# EAGLE design lcmxo2-2000hc_bb (EAGLE 7.3.0)
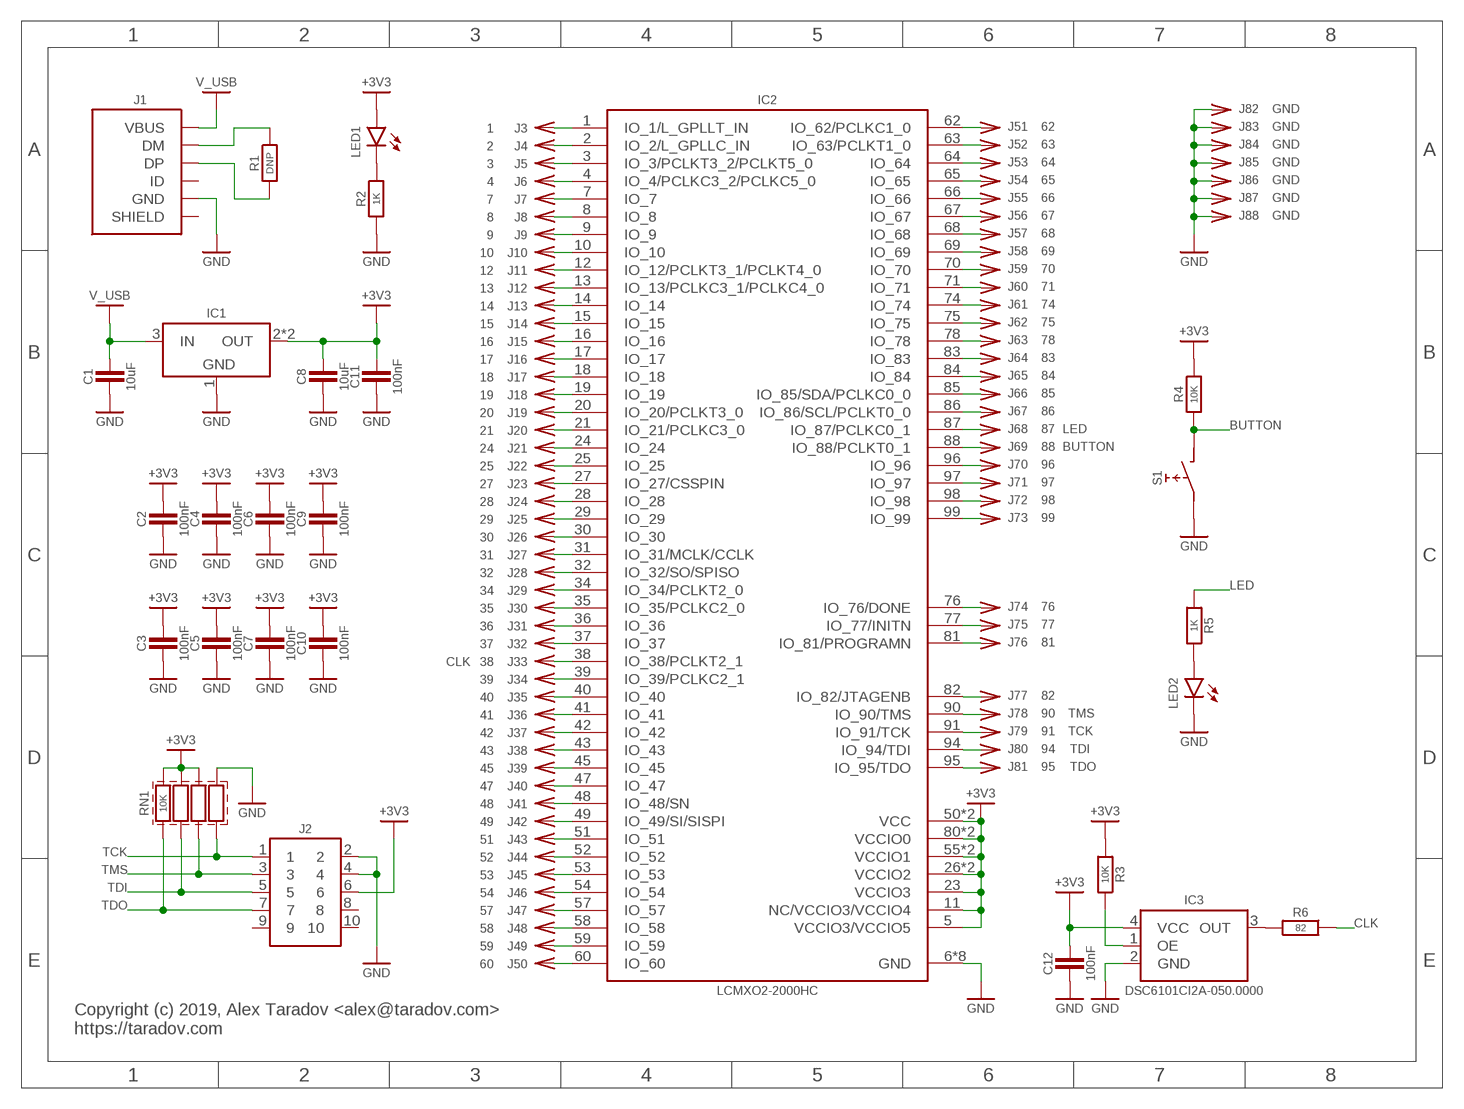
[diagram p0: schematic, sheet 1]

## Parts
C1  10uF  C-0805  [SMD0805]
C2  100nF  C-0603  [SMD0603]
C3  100nF  C-0603  [SMD0603]
C4  100nF  C-0603  [SMD0603]
C5  100nF  C-0603  [SMD0603]
C6  100nF  C-0603  [SMD0603]
C7  100nF  C-0603  [SMD0603]
C8  10uF  C-0805  [SMD0805]
C9  100nF  C-0603  [SMD0603]
C10  100nF  C-0603  [SMD0603]
C11  100nF  C-0603  [SMD0603]
C12  100nF  C-0603  [SMD0603]
IC1  LM1117-SOT223  [SOT223]
IC2  LCMXO2-2000HC  LCMXO2-100  [TQFP-100-0.5MM]
IC3  DSC6101CI2A-050.0000  OSC_EN-CDFN4  [CDFN4]
J1  USB-B-MICRO-SMT  [USB-B-MICRO-SMT-SHELL-TH]
J2  HEADER-5X2-TH-1.27  [HEADER-5X2-1.27MM]
J3  1  CONN-SINGLE-TH  [PIN-TH]
J4  2  CONN-SINGLE-TH  [PIN-TH]
J5  3  CONN-SINGLE-TH  [PIN-TH]
J6  4  CONN-SINGLE-TH  [PIN-TH]
J7  7  CONN-SINGLE-TH  [PIN-TH]
J8  8  CONN-SINGLE-TH  [PIN-TH]
J9  9  CONN-SINGLE-TH  [PIN-TH]
J10  10  CONN-SINGLE-TH  [PIN-TH]
J11  12  CONN-SINGLE-TH  [PIN-TH]
J12  13  CONN-SINGLE-TH  [PIN-TH]
J13  14  CONN-SINGLE-TH  [PIN-TH]
J14  15  CONN-SINGLE-TH  [PIN-TH]
J15  16  CONN-SINGLE-TH  [PIN-TH]
J16  17  CONN-SINGLE-TH  [PIN-TH]
J17  18  CONN-SINGLE-TH  [PIN-TH]
J18  19  CONN-SINGLE-TH  [PIN-TH]
J19  20  CONN-SINGLE-TH  [PIN-TH]
J20  21  CONN-SINGLE-TH  [PIN-TH]
J21  24  CONN-SINGLE-TH  [PIN-TH]
J22  25  CONN-SINGLE-TH  [PIN-TH]
J23  27  CONN-SINGLE-TH  [PIN-TH]
J24  28  CONN-SINGLE-TH  [PIN-TH]
J25  29  CONN-SINGLE-TH  [PIN-TH]
J26  30  CONN-SINGLE-TH  [PIN-TH]
J27  31  CONN-SINGLE-TH  [PIN-TH]
J28  32  CONN-SINGLE-TH  [PIN-TH]
J29  34  CONN-SINGLE-TH  [PIN-TH]
J30  35  CONN-SINGLE-TH  [PIN-TH]
J31  36  CONN-SINGLE-TH  [PIN-TH]
J32  37  CONN-SINGLE-TH  [PIN-TH]
J33  38  CONN-SINGLE-TH  [PIN-TH]
J34  39  CONN-SINGLE-TH  [PIN-TH]
J35  40  CONN-SINGLE-TH  [PIN-TH]
J36  41  CONN-SINGLE-TH  [PIN-TH]
J37  42  CONN-SINGLE-TH  [PIN-TH]
J38  43  CONN-SINGLE-TH  [PIN-TH]
J39  45  CONN-SINGLE-TH  [PIN-TH]
J40  47  CONN-SINGLE-TH  [PIN-TH]
J41  48  CONN-SINGLE-TH  [PIN-TH]
J42  49  CONN-SINGLE-TH  [PIN-TH]
J43  51  CONN-SINGLE-TH  [PIN-TH]
J44  52  CONN-SINGLE-TH  [PIN-TH]
J45  53  CONN-SINGLE-TH  [PIN-TH]
J46  54  CONN-SINGLE-TH  [PIN-TH]
J47  57  CONN-SINGLE-TH  [PIN-TH]
J48  58  CONN-SINGLE-TH  [PIN-TH]
J49  59  CONN-SINGLE-TH  [PIN-TH]
J50  60  CONN-SINGLE-TH  [PIN-TH]
J51  62  CONN-SINGLE-TH  [PIN-TH]
J52  63  CONN-SINGLE-TH  [PIN-TH]
J53  64  CONN-SINGLE-TH  [PIN-TH]
J54  65  CONN-SINGLE-TH  [PIN-TH]
J55  66  CONN-SINGLE-TH  [PIN-TH]
J56  67  CONN-SINGLE-TH  [PIN-TH]
J57  68  CONN-SINGLE-TH  [PIN-TH]
J58  69  CONN-SINGLE-TH  [PIN-TH]
J59  70  CONN-SINGLE-TH  [PIN-TH]
J60  71  CONN-SINGLE-TH  [PIN-TH]
J61  74  CONN-SINGLE-TH  [PIN-TH]
J62  75  CONN-SINGLE-TH  [PIN-TH]
J63  78  CONN-SINGLE-TH  [PIN-TH]
J64  83  CONN-SINGLE-TH  [PIN-TH]
J65  84  CONN-SINGLE-TH  [PIN-TH]
J66  85  CONN-SINGLE-TH  [PIN-TH]
J67  86  CONN-SINGLE-TH  [PIN-TH]
J68  87  CONN-SINGLE-TH  [PIN-TH]
J69  88  CONN-SINGLE-TH  [PIN-TH]
J70  96  CONN-SINGLE-TH  [PIN-TH]
J71  97  CONN-SINGLE-TH  [PIN-TH]
J72  98  CONN-SINGLE-TH  [PIN-TH]
J73  99  CONN-SINGLE-TH  [PIN-TH]
J74  76  CONN-SINGLE-TH  [PIN-TH]
J75  77  CONN-SINGLE-TH  [PIN-TH]
J76  81  CONN-SINGLE-TH  [PIN-TH]
J77  82  CONN-SINGLE-TH  [PIN-TH]
J78  90  CONN-SINGLE-TH  [PIN-TH]
J79  91  CONN-SINGLE-TH  [PIN-TH]
J80  94  CONN-SINGLE-TH  [PIN-TH]
J81  95  CONN-SINGLE-TH  [PIN-TH]
J82  GND  CONN-SINGLE-TH  [PIN-TH]
J83  GND  CONN-SINGLE-TH  [PIN-TH]
J84  GND  CONN-SINGLE-TH  [PIN-TH]
J85  GND  CONN-SINGLE-TH  [PIN-TH]
J86  GND  CONN-SINGLE-TH  [PIN-TH]
J87  GND  CONN-SINGLE-TH  [PIN-TH]
J88  GND  CONN-SINGLE-TH  [PIN-TH]
LED1  LED_SMDLED_0603  [SMD0603]
LED2  LED_SMDLED_0603  [SMD0603]
R1  DNP  R-0603  [SMD0603]
R2  1K  R-0603  [SMD0603]
R3  10K  R-0603  [SMD0603]
R4  10K  R-0603  [SMD0603]
R5  1K  R-0603  [SMD0603]
R6  82  R-0603  [SMD0603]
RN1  10K  RN-4-0603-X4  [SMD0603-X4]
S1  TACT_SWITCH_6MM-SMD-HALF  [TACT-SMD-6MM-HALF]

## Nets
+3V3: C2.2 C3.2 C4.2 C5.2 C6.2 C7.2 C8.2 C9.2 C10.2 C11.2 C12.2 IC1.2(OUT) IC1.4(OUT) IC2.5(VCCIO3/VCCIO5) IC2.11(NC/VCCIO3/VCCIO4) IC2.23(VCCIO3) IC2.26(VCCIO2) IC2.46(VCCIO2) IC2.50(VCC) IC2.55(VCCIO1) IC2.73(VCCIO1) IC2.80(VCCIO0) IC2.93(VCCIO0) IC2.100(VCC) IC3.4(VCC) J2.6 LED1.1(A) R3.1 R4.2 RN1.6 RN1.7 RN1.8
BUTTON: IC2.88(IO_88/PCLKT0_1) J69.1 R4.1 S1.2
CLK: IC2.38(IO_38/PCLKT2_1) J33.1 R6.2
GND: C1.1 C2.1 C3.1 C4.1 C5.1 C6.1 C7.1 C8.1 C9.1 C10.1 C11.1 C12.1 IC1.1(GND) IC2.6(GND) IC2.22(GND) IC2.33(GND) IC2.44(GND) IC2.56(GND) IC2.72(GND) IC2.79(GND) IC2.92(GND) IC3.2(GND) J1.5(GND) J2.2 J2.4 J82.1 J83.1 J84.1 J85.1 J86.1 J87.1 J88.1 LED2.2(C) R2.1 RN1.5 S1.1
JTAGEN: IC2.82(IO_82/JTAGENB) J77.1
LED: IC2.87(IO_87/PCLKC0_1) J68.1 R5.1
N$1: IC2.1(IO_1/L_GPLLT_IN) J3.1
N$2: IC2.2(IO_2/L_GPLLC_IN) J4.1
N$3: IC2.3(IO_3/PCLKT3_2/PCLKT5_0) J5.1
N$4: J1.2(DM) R1.2
N$5: IC2.4(IO_4/PCLKC3_2/PCLKC5_0) J6.1
N$6: J1.3(DP) R1.1
N$7: IC2.7(IO_7) J7.1
N$9: IC2.8(IO_8) J8.1
N$10: IC2.9(IO_9) J9.1
N$12: IC2.10(IO_10) J10.1
N$13: IC2.12(IO_12/PCLKT3_1/PCLKT4_0) J11.1
N$14: IC2.13(IO_13/PCLKC3_1/PCLKC4_0) J12.1
N$15: IC2.14(IO_14) J13.1
N$16: IC2.15(IO_15) J14.1
N$17: IC2.16(IO_16) J15.1
N$18: IC2.17(IO_17) J16.1
N$19: IC2.18(IO_18) J17.1
N$20: IC2.19(IO_19) J18.1
N$21: IC2.20(IO_20/PCLKT3_0) J19.1
N$22: IC2.21(IO_21/PCLKC3_0) J20.1
N$23: IC2.24(IO_24) J21.1
N$24: IC2.25(IO_25) J22.1
N$25: IC2.27(IO_27/CSSPIN) J23.1
N$26: IC2.28(IO_28) J24.1
N$27: IC2.29(IO_29) J25.1
N$28: IC2.30(IO_30) J26.1
N$29: IC2.31(IO_31/MCLK/CCLK) J27.1
N$30: IC2.32(IO_32/SO/SPISO) J28.1
N$31: IC2.34(IO_34/PCLKT2_0) J29.1
N$32: IC2.35(IO_35/PCLKC2_0) J30.1
N$33: IC2.36(IO_36) J31.1
N$34: IC2.37(IO_37) J32.1
N$35: IC3.3(OUT) R6.1
N$36: IC3.1(OE) R3.2
N$38: IC2.39(IO_39/PCLKC2_1) J34.1
N$39: IC2.40(IO_40) J35.1
N$40: IC2.41(IO_41) J36.1
N$41: IC2.42(IO_42) J37.1
N$42: IC2.43(IO_43) J38.1
N$43: IC2.45(IO_45) J39.1
N$44: IC2.47(IO_47) J40.1
N$45: IC2.48(IO_48/SN) J41.1
N$46: IC2.49(IO_49/SI/SISPI) J42.1
N$47: IC2.51(IO_51) J43.1
N$48: IC2.52(IO_52) J44.1
N$49: IC2.53(IO_53) J45.1
N$50: IC2.54(IO_54) J46.1
N$51: IC2.57(IO_57) J47.1
N$52: IC2.58(IO_58) J48.1
N$53: IC2.59(IO_59) J49.1
N$54: LED2.1(A) R5.2
N$55: IC2.60(IO_60) J50.1
N$56: IC2.62(IO_62/PCLKC1_0) J51.1
N$57: IC2.63(IO_63/PCLKT1_0) J52.1
N$58: IC2.99(IO_99) J73.1
N$59: IC2.98(IO_98) J72.1
N$60: IC2.64(IO_64) J53.1
N$61: IC2.65(IO_65) J54.1
N$62: IC2.66(IO_66) J55.1
N$63: IC2.67(IO_67) J56.1
N$64: IC2.68(IO_68) J57.1
N$65: IC2.69(IO_69) J58.1
N$66: IC2.70(IO_70) J59.1
N$67: IC2.71(IO_71) J60.1
N$68: IC2.74(IO_74) J61.1
N$69: IC2.75(IO_75) J62.1
N$70: IC2.78(IO_78) J63.1
N$71: IC2.83(IO_83) J64.1
N$72: IC2.84(IO_84) J65.1
N$73: IC2.85(IO_85/SDA/PCLKC0_0) J66.1
N$74: IC2.86(IO_86/SCL/PCLKT0_0) J67.1
N$77: IC2.96(IO_96) J70.1
N$78: IC2.97(IO_97) J71.1
N$79: IC2.76(IO_76/DONE) J74.1
N$80: IC2.77(IO_77/INITN) J75.1
N$81: IC2.81(IO_81/PROGRAMN) J76.1
N$84: LED1.2(C) R2.2
TCK: IC2.91(IO_91/TCK) J2.1 J79.1 RN1.4
TDI: IC2.94(IO_94/TDI) J2.5 J80.1 RN1.2
TDO: IC2.95(IO_95/TDO) J2.7 J81.1 RN1.1
TMS: IC2.90(IO_90/TMS) J2.3 J78.1 RN1.3
V_USB: C1.2 IC1.3(IN) J1.1(VBUS)
Unconnected: J1.4(ID) J1.M1(SHIELD) J1.M2(SHIELD) J1.M3(SHIELD) J1.M4(SHIELD) J2.8 J2.9 J2.10

## Notes on the sheet
- Copyright (c) 2019, Alex Taradov <alex@taradov.com>
  https://taradov.com

## Library data of the parts
C1-C12 = ataradov_rlc:C
IC1 = ataradov_vreg:LM1117: LM1117 voltage regulator
IC2 = ataradov_pld:LCMXO2-100
IC3 = ataradov_crystal:OSC_EN: Generic oscillator with output enable
J1 = ataradov_conn:USB-B-MICRO
J2 = ataradov_conn:HEADER-5X2
J3-J88 = ataradov_conn:CONN-SINGLE
LED1 LED2 = ataradov_led:LED_SMD: SMD_LED
R1-R6 = ataradov_rlc:R
RN1 = ataradov_rlc:RN-4
S1 = ataradov_switch:TACT_SWITCH_6MM

## Board
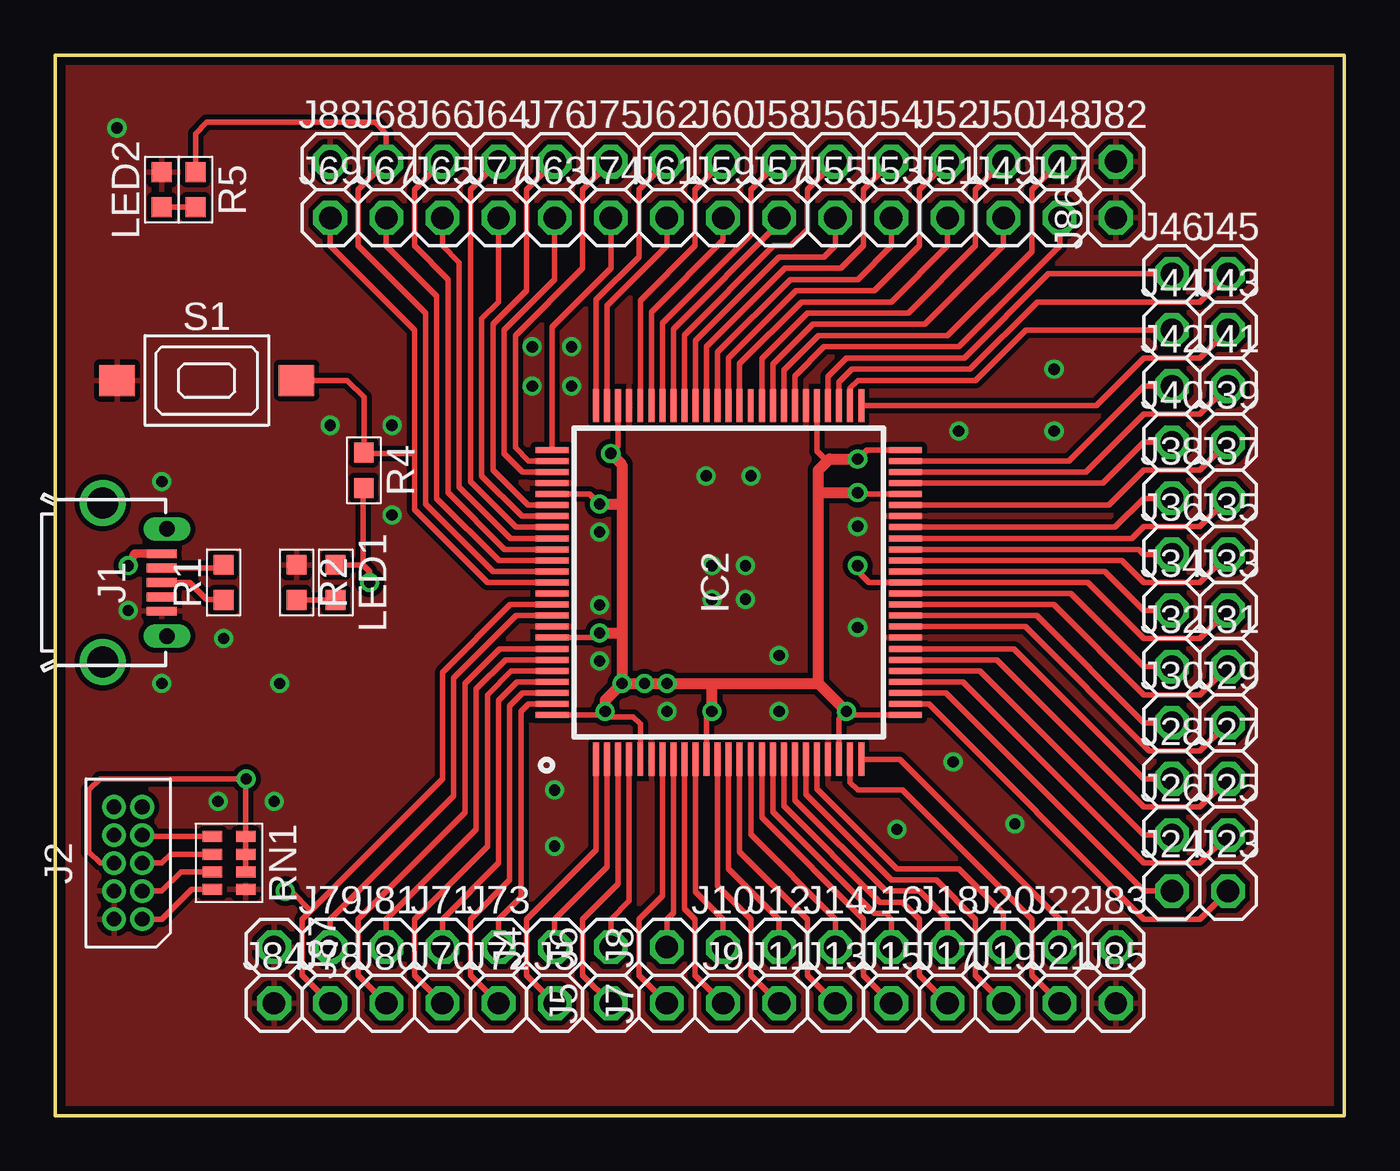
[diagram p1: board, top side]
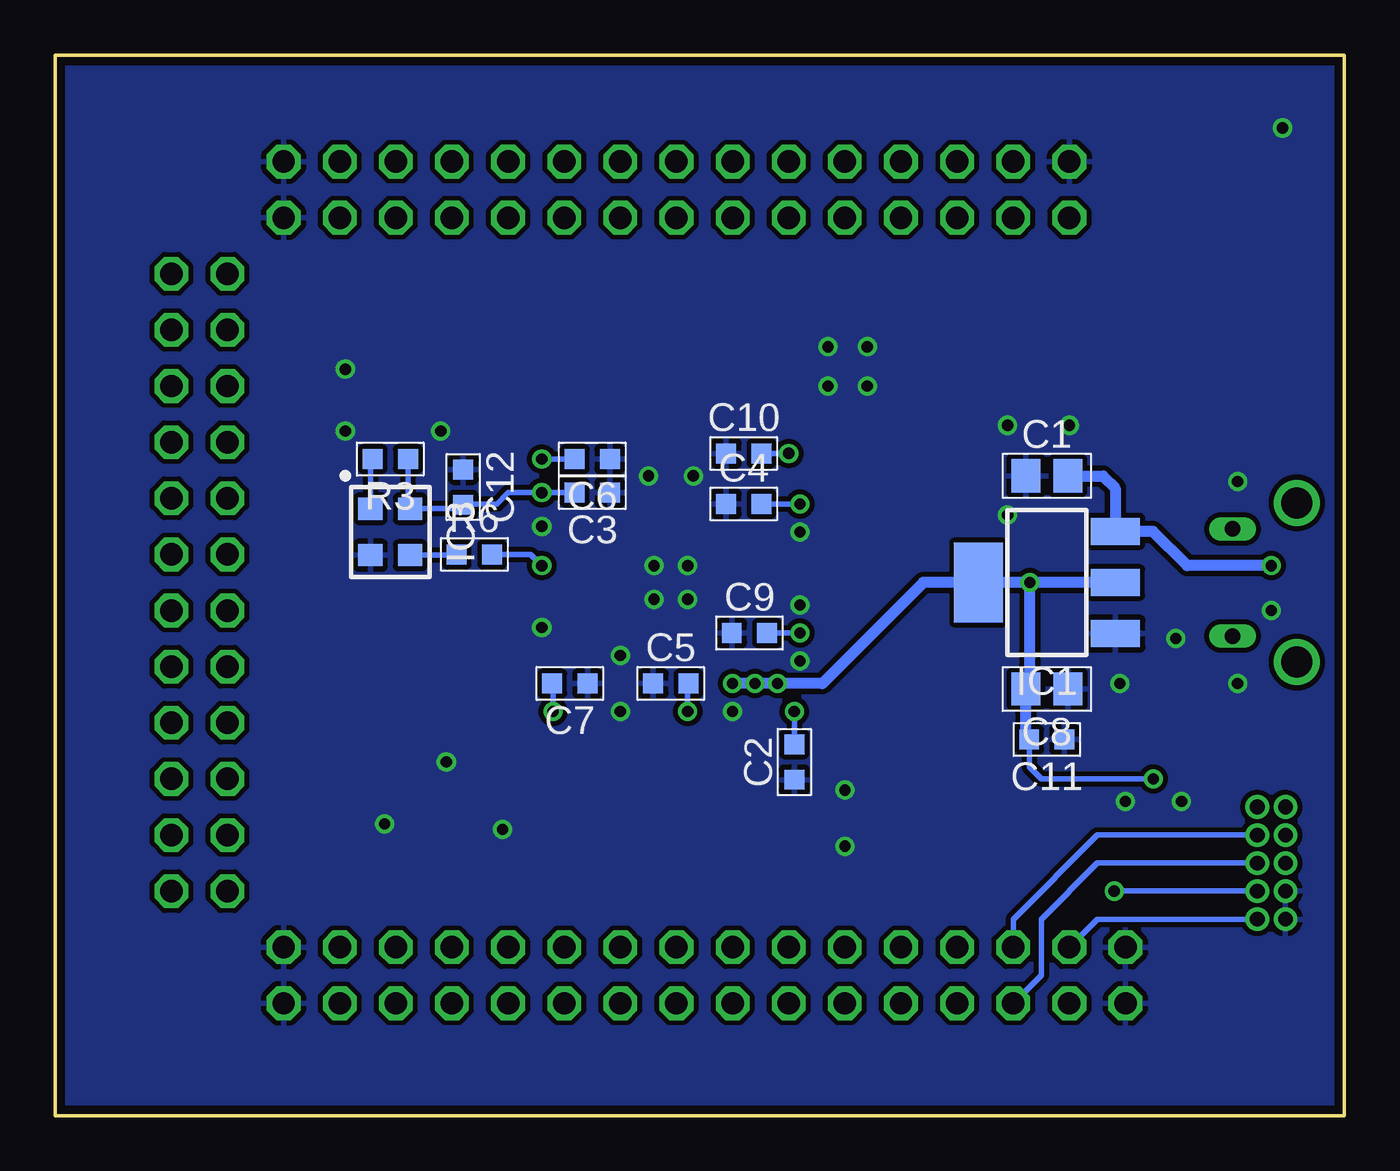
[diagram p2: board, bottom side, seen from below]

Size 58.34 x 48 mm. Coordinates in mm from the lower left corner, seen from the top.
Outline: 0,0 58.34,0 58.34,48 0,48 0,0
Copper layers (1*16): Top 0.0356mm / dielectric 1.5011mm / Bottom 0.0356mm
Design rules "std-tented": minimum track width 6mil, minimum drill 13mil, track to track 6mil, track to pad 6mil, pad to pad 6mil, via to via 6mil, smd to smd 6mil, copper to edge 15mil, drill to drill 6mil, minimum pad ring 7mil, minimum via ring 7mil, stop-mask expansion 3mil, vias tented up to drill 25mil, thermal gap 10mil

### Footprints (pad centres in the part's own frame; a part is rotated, then mirrored left to right if it is on the bottom)
SMD0805 = smd 1.3 x 1.5: 1 -0.95,0; 2 0.95,0
SMD0603 = smd 0.9 x 0.9: 1 -0.8,0; 2 0.8,0
SOT223 = smd 1.219 x 2.235: 1 -2.311,-3.099; 2 0,-3.099; 3 2.311,-3.099 | smd 3.6 x 2.2: 4 0,3.099
TQFP-100-0.5MM = smd 1.5 x 0.27: 1 -8,6; 2 -8,5.5; 3 -8,5; 4 -8,4.5; 5 -8,4; 6 -8,3.5; 7 -8,3; 8 -8,2.5; 9 -8,2; 10 -8,1.5; 11 -8,1; 12 -8,0.5; 13 -8,0; 14 -8,-0.5; 15 -8,-1; 16 -8,-1.5; 17 -8,-2; 18 -8,-2.5; 19 -8,-3; 20 -8,-3.5; 21 -8,-4; 22 -8,-4.5; 23 -8,-5; 24 -8,-5.5; 25 -8,-6; 51 8,-6; 52 8,-5.5; 53 8,-5; 54 8,-4.5; 55 8,-4; 56 8,-3.5; 57 8,-3; 58 8,-2.5; 59 8,-2; 60 8,-1.5; 61 8,-1; 62 8,-0.5; 63 8,0; 64 8,0.5; 65 8,1; 66 8,1.5; 67 8,2; 68 8,2.5; 69 8,3; 70 8,3.5; 71 8,4; 72 8,4.5; 73 8,5; 74 8,5.5; 75 8,6 | smd 0.27 x 1.5: 26 -6,-8; 27 -5.5,-8; 28 -5,-8; 29 -4.5,-8; 30 -4,-8; 31 -3.5,-8; 32 -3,-8; 33 -2.5,-8; 34 -2,-8; 35 -1.5,-8; 36 -1,-8; 37 -0.5,-8; 38 0,-8; 39 0.5,-8; 40 1,-8; 41 1.5,-8; 42 2,-8; 43 2.5,-8; 44 3,-8; 45 3.5,-8; 46 4,-8; 47 4.5,-8; 48 5,-8; 49 5.5,-8; 50 6,-8; 76 6,8; 77 5.5,8; 78 5,8; 79 4.5,8; 80 4,8; 81 3.5,8; 82 3,8; 83 2.5,8; 84 2,8; 85 1.5,8; 86 1,8; 87 0.5,8; 88 0,8; 89 -0.5,8; 90 -1,8; 91 -1.5,8; 92 -2,8; 93 -2.5,8; 94 -3,8; 95 -3.5,8; 96 -4,8; 97 -4.5,8; 98 -5,8; 99 -5.5,8; 100 -6,8
CDFN4 = smd 1 x 1.1: 1 -1.05,-0.9; 2 1.05,-0.9; 3 1.05,0.9; 4 -1.05,0.9
USB-B-MICRO-SMT-SHELL-TH = smd 1.35 x 0.4: 1 4.825,1.3; 2 4.825,0.65; 3 4.825,0; 4 4.825,-0.65; 5 4.825,-1.3 | drill 1.397: M1 2.15,-3.6; M2 2.15,3.6 | drill 0.7 long: M3 5.05,2.425; M4 5.05,-2.425
HEADER-5X2-1.27MM = drill 0.66 pad 1.067: 1 -2.54,-0.635; 2 -2.54,0.635; 3 -1.27,-0.635; 4 -1.27,0.635; 5 0,-0.635; 6 0,0.635; 7 1.27,-0.635; 8 1.27,0.635; 9 2.54,-0.635; 10 2.54,0.635
PIN-TH = drill 1.016 octagon: 1 0,0
SMD0603-X4 = smd 0.5 x 0.889: 1 -1.2,-0.752; 2 -0.4,-0.752; 3 0.4,-0.752; 4 1.2,-0.752; 5 1.2,0.752; 6 0.4,0.752; 7 -0.4,0.752; 8 -1.2,0.752
TACT-SMD-6MM-HALF = smd 1.6 x 1.4: 1 -4.064,0; 2 4.064,0

### Placement (x,y rotation side)
C1  13.46,28.96 0 bottom
C2  24.89,16 90 bottom
C3  34.04,28.19 180 bottom
C4  27.18,27.69 0 bottom
C5  30.48,19.56 0 bottom
C6  34.04,29.72 180 bottom
C7  35.05,19.56 180 bottom
C8  13.46,19.3 180 bottom
C9  26.92,21.84 0 bottom
C10  27.18,29.97 0 bottom
C11  13.46,17.02 180 bottom
C12  39.88,28.45 270 bottom
IC1  13.46,24.13 90 bottom
IC2  30.48,24.13 90 top
IC3  43.18,26.42 270 bottom
J1  0,24.13 0 top
J2  3.3,11.43 90 top
J3  22.61,5.08 0 top
J4  22.61,7.62 90 top
J5  25.15,5.08 90 top
J6  25.15,7.62 90 top
J7  27.69,5.08 90 top
J8  27.69,7.62 90 top
J9  30.23,5.08 0 top
J10  30.23,7.62 0 top
J11  32.77,5.08 0 top
J12  32.77,7.62 0 top
J13  35.31,5.08 0 top
J14  35.31,7.62 0 top
J15  37.85,5.08 0 top
J16  37.85,7.62 0 top
J17  40.39,5.08 0 top
J18  40.39,7.62 0 top
J19  42.93,5.08 0 top
J20  42.93,7.62 0 top
J21  45.47,5.08 0 top
J22  45.47,7.62 0 top
J23  53.09,10.16 0 top
J24  50.55,10.16 0 top
J25  53.09,12.7 0 top
J26  50.55,12.7 0 top
J27  53.09,15.24 0 top
J28  50.55,15.24 0 top
J29  53.09,17.78 0 top
J30  50.55,17.78 0 top
J31  53.09,20.32 0 top
J32  50.55,20.32 0 top
J33  53.09,22.86 0 top
J34  50.55,22.86 0 top
J35  53.09,25.4 0 top
J36  50.55,25.4 0 top
J37  53.09,27.94 0 top
J38  50.55,27.94 0 top
J39  53.09,30.48 0 top
J40  50.55,30.48 0 top
J41  53.09,33.02 0 top
J42  50.55,33.02 0 top
J43  53.09,35.56 0 top
J44  50.55,35.56 0 top
J45  53.09,38.1 0 top
J46  50.55,38.1 0 top
J47  45.47,40.64 0 top
J48  45.47,43.18 0 top
J49  42.93,40.64 0 top
J50  42.93,43.18 0 top
J51  40.39,40.64 0 top
J52  40.39,43.18 0 top
J53  37.85,40.64 0 top
J54  37.85,43.18 0 top
J55  35.31,40.64 0 top
J56  35.31,43.18 0 top
J57  32.77,40.64 0 top
J58  32.77,43.18 0 top
J59  30.23,40.64 0 top
J60  30.23,43.18 0 top
J61  27.69,40.64 0 top
J62  27.69,43.18 0 top
J63  22.61,40.64 0 top
J64  20.07,43.18 0 top
J65  17.53,40.64 0 top
J66  17.53,43.18 0 top
J67  14.99,40.64 0 top
J68  14.99,43.18 0 top
J69  12.45,40.64 0 top
J70  17.53,5.08 0 top
J71  17.53,7.62 0 top
J72  20.07,5.08 0 top
J73  20.07,7.62 0 top
J74  25.15,40.64 0 top
J75  25.15,43.18 0 top
J76  22.61,43.18 0 top
J77  20.07,40.64 0 top
J78  12.45,5.08 0 top
J79  12.45,7.62 0 top
J80  14.99,5.08 0 top
J81  14.99,7.62 0 top
J82  48.01,43.18 0 top
J83  48.01,7.62 0 top
J84  9.91,5.08 0 top
J85  48.01,5.08 0 top
J86  48.01,40.64 90 top
J87  9.91,7.62 270 top
J88  12.45,43.18 0 top
LED1  12.7,24.13 270 top
LED2  4.83,41.91 90 top
R1  7.62,24.13 90 top
R2  10.92,24.13 270 top
R3  43.18,29.72 180 bottom
R4  13.97,29.21 270 top
R5  6.35,41.91 270 top
R6  39.37,25.4 0 bottom
RN1  7.87,11.43 270 top
S1  6.86,33.27 0 top

### Tracks (layer width: path | path; a pad name or v marks a point on that pad's centre or on a via)
+3V3  (via drill 0.51)
  Top 0.254: J2.6 2.03,11.43 1.52,11.94 1.52,14.73 2.03,15.24 v8.64,15.24 8.63,15.23 RN1.8 RN1.7 RN1.6 | IC2.26 35.97,18.13 v35.81,18.29 35.48,17.95 IC2.23 | v24.64,27.69 24.19,28.13 IC2.80 | v25.15,29.97 25.48,30.31 IC2.73 | v36.32,28.19 36.39,28.13 IC2.46 | IC2.55 34.48,30.07 C6.2 v36.32,29.72 36.73,30.13 IC2.50 | v24.64,21.84 24.42,21.63 IC2.93 | v29.72,18.29 29.48,18.05 IC2.11 | IC2.100 24.73,18.13 v24.89,18.29 25.15,18.03 26.16,18.03 26.48,17.72 IC2.5 | LED1.1 13.93,24.93 | 13.93,24.93 14.22,24.64 v14.22,24.13 | R4.2 13.93,28.37 13.93,24.93
  Top 0.508: 25.65,27.69 25.65,29.46 v25.15,29.97 | 25.65,27.69 25.65,21.84 | 25.65,21.84 v25.65,19.56 | v25.65,19.56 29.72,19.56 | 29.72,19.56 34.54,19.56 | 34.54,19.56 34.54,28.19 | 34.54,28.19 34.54,29.21 35.05,29.72 v36.32,29.72 | v24.64,27.69 25.65,27.69 | v24.64,21.84 25.65,21.84 | 34.54,28.19 v36.32,28.19 | v29.72,18.29 29.72,19.56 | 34.54,19.56 v35.81,18.29 | v25.65,19.56 24.89,18.8 v24.89,18.29
  Bottom 0.254: C10.2 v25.15,29.97 | C9.2 v24.64,21.84 | C4.2 v24.64,27.69 | C3.2 v36.32,28.19 37.85,28.19 38.35,27.69 39.84,27.69 C12.2 40.06,27.47 IC3.4 42.38,27.57 R3.1 | C6.2 v36.32,29.72 | C7.2 35.81,19.52 v35.81,18.29 | C5.2 29.72,19.52 v29.72,18.29 | 14.41,17.17 C11.2 14.26,15.79 13.72,15.24 v8.64,15.24 | C8.2 14.22,19.49 | C2.2 v24.89,18.29
  Bottom 0.508: IC1.2 v14.22,24.13 | v14.22,24.13 IC1.4 19.05,24.13 23.62,19.56 v25.65,19.56 v26.67,19.56 v27.69,19.56 | 14.41,17.17 C8.2 | 14.22,19.49 v14.22,24.13
BUTTON
  Top 0.254: J69.1 12.45,39.37 16.26,35.56 16.26,29.97 | 16.26,29.97 16.26,27.43 19.56,24.13 IC2.88 | 16.26,29.97 14.01,29.97 R4.1 13.97,32.51 13.21,33.27 S1.2
CLK  (via drill 0.51)
  Top 0.254: J33.1 51.82,21.59 49.28,21.59 46.74,24.13 IC2.38 36.83,24.13 36.32,24.64 v36.32,24.89
  Bottom 0.254: R6.2 36.83,25.4 v36.32,24.89
GND  (via drill 0.51 pad 0.25)
  other vias: 7.62,21.59 3.3,22.86 4.83,28.7 4.83,19.56 31.24,24.89 40.64,16 43.43,13.21 45.21,30.99 23.37,34.8 29.72,24.89 29.72,23.37 22.61,12.19 31.5,28.96 36.32,26.67 29.46,28.96 36.32,22.1 31.24,23.37 24.64,20.57 32.77,18.29 24.64,23.11 24.64,26.42 27.69,18.29 32.77,20.83 22.61,14.73 10.16,19.56 45.21,33.78 40.89,30.99 38.1,12.95 21.59,33.02 21.59,34.8 23.37,33.02 7.37,14.22 9.91,14.22 15.24,27.18 15.24,31.24 12.45,31.24 2.79,44.7
  pour Bottom (isolate 0.229): 0,48.01 58.42,48.01 58.42,0 0,0
  pour Top (isolate 0.229): 0,48.01 58.42,48.01 58.42,0 0,0
JTAGEN
  Top 0.254: J77.1 20.07,36.83 19.3,36.07 19.3,28.96 21.13,27.13 IC2.82
LED
  Top 0.254: IC2.87 19.82,24.63 16.76,27.69 16.76,36.32 13.72,39.37 13.72,41.91 J68.1 14.99,44.45 14.48,44.96 6.86,44.96 6.35,44.45 R5.1
N$1
  Top 0.254: J3.1 21.34,6.35 21.34,8.89 24.48,12.03 IC2.1
N$2
  Top 0.254: J4.1 22.61,8.89 24.98,11.26 IC2.2
N$3
  Top 0.254: J5.1 23.88,6.35 23.88,8.89 25.48,10.49 IC2.3
N$4
  Top 0.254: R1.2 7.47,24.78 J1.2
N$5
  Top 0.254: J6.1 25.15,8.89 25.98,9.72 IC2.4
N$6
  Top 0.254: R1.1 7.58,23.37 6.86,23.37 6.1,24.13 J1.3
N$7
  Top 0.254: J7.1 26.42,6.35 26.42,8.89 27.48,9.95 IC2.7
N$9
  Top 0.254: J8.1 27.69,8.89 27.98,9.18 IC2.8
N$10
  Top 0.254: J9.1 28.96,6.35 28.96,8.89 28.48,9.37 IC2.9
N$12
  Top 0.254: J10.1 30.23,8.89 28.98,10.14 IC2.10
N$13
  Top 0.254: J11.1 31.5,6.35 31.5,8.89 29.98,10.41 IC2.12
N$14
  Top 0.254: J12.1 32.77,8.89 30.48,11.18 IC2.13
N$15
  Top 0.254: J13.1 34.04,6.35 34.04,8.89 30.98,11.95 IC2.14
N$16
  Top 0.254: J14.1 35.31,8.89 31.48,12.72 IC2.15
N$17
  Top 0.254: J15.1 36.58,6.35 36.58,8.89 31.98,13.49 IC2.16
N$18
  Top 0.254: J16.1 37.85,8.89 37.59,9.14 37.08,9.14 32.48,13.75 IC2.17
N$19
  Top 0.254: J17.1 39.12,6.35 39.12,8.89 38.35,9.65 37.34,9.65 32.98,14.01 IC2.18
N$20
  Top 0.254: J18.1 40.39,8.89 39.12,10.16 37.59,10.16 33.48,14.27 IC2.19
N$21
  Top 0.254: J19.1 41.66,6.35 41.66,8.89 39.88,10.67 37.85,10.67 33.98,14.53 IC2.20
N$22
  Top 0.254: J20.1 42.93,9.14 40.89,11.18 38.1,11.18 34.48,14.8 IC2.21
N$23
  Top 0.254: J21.1 44.2,6.35 44.2,8.89 38.35,14.73 36.32,14.73 35.98,15.07 IC2.24
N$24
  Top 0.254: J22.1 45.47,8.89 38.23,16.13 IC2.25
N$25
  Top 0.254: J23.1 51.82,8.89 49.28,8.89 39.54,18.63 IC2.27
N$26
  Top 0.254: J24.1 49.28,10.16 40.31,19.13 IC2.28
N$27
  Top 0.254: J25.1 51.82,11.43 49.28,11.43 41.08,19.63 IC2.29
N$28
  Top 0.254: J26.1 49.28,12.7 41.85,20.13 IC2.30
N$29
  Top 0.254: J27.1 51.82,13.97 49.28,13.97 42.62,20.63 IC2.31
N$30
  Top 0.254: J28.1 49.28,15.24 43.39,21.13 IC2.32
N$31
  Top 0.254: J29.1 51.82,16.51 49.53,16.51 43.91,22.13 IC2.34
N$32
  Top 0.254: J30.1 49.28,17.78 44.43,22.63 IC2.35
N$33
  Top 0.254: J31.1 51.82,19.05 49.28,19.05 45.2,23.13 IC2.36
N$34
  Top 0.254: J32.1 49.28,20.32 45.97,23.63 IC2.37
N$35
  Bottom 0.254: R6.1 40.2,25.37 IC3.3
N$36
  Bottom 0.254: R3.2 44.08,29.62 IC3.1
N$38
  Top 0.254: J34.1 49.28,22.86 47.51,24.63 IC2.39
N$39
  Top 0.254: J35.1 51.82,24.13 49.28,24.13 48.28,25.13 IC2.40
N$40
  Top 0.254: J36.1 49.28,25.4 49.05,25.63 IC2.41
N$41
  Top 0.254: J37.1 51.82,26.67 49.28,26.67 48.74,26.13 IC2.42
N$42
  Top 0.254: J38.1 49.28,27.94 47.97,26.63 IC2.43
N$43
  Top 0.254: J39.1 51.82,29.21 49.28,29.21 47.7,27.63 IC2.45
N$44
  Top 0.254: J40.1 49.28,30.48 47.43,28.63 IC2.47
N$45
  Top 0.254: J41.1 51.82,31.75 49.28,31.75 46.66,29.13 IC2.48
N$46
  Top 0.254: J42.1 49.28,33.02 45.89,29.63 IC2.49
N$47
  Top 0.254: J43.1 51.82,34.29 49.28,34.29 47.12,32.13 IC2.51
N$48
  Top 0.254: IC2.52 35.98,32.93 36.32,33.27 41.66,33.27 43.94,35.56 J44.1
N$49
  Top 0.254: IC2.53 35.48,33.19 36.07,33.78 41.4,33.78 44.45,36.83 51.82,36.83 J45.1
N$50
  Top 0.254: IC2.54 34.98,33.46 35.81,34.29 41.15,34.29 44.96,38.1 J46.1
N$51
  Top 0.254: J47.1 45.47,39.37 40.89,34.8 34.8,34.8 33.48,33.48 IC2.57
N$52
  Top 0.254: J48.1 44.2,41.91 44.2,39.12 40.39,35.31 34.54,35.31 32.98,33.74 IC2.58
N$53
  Top 0.254: J49.1 42.93,39.37 39.37,35.81 34.29,35.81 32.48,34 IC2.59
N$54
  Top 0.254: LED2.1 R5.2
N$55
  Top 0.254: J50.1 41.66,41.91 41.66,39.37 38.61,36.32 34.04,36.32 31.98,34.27 IC2.60
N$56
  Top 0.254: J51.1 40.39,39.37 37.85,36.83 33.78,36.83 30.98,34.03 IC2.62
N$57
  Top 0.254: J52.1 39.12,41.91 39.12,39.37 37.08,37.34 33.53,37.34 30.48,34.29 IC2.63
N$58
  Top 0.254: J73.1 20.07,8.89 21.08,9.91 21.08,18.29 21.42,18.63 IC2.99
N$59
  Top 0.254: J72.1 18.8,6.35 18.8,8.89 20.57,10.67 20.57,18.54 21.16,19.13 IC2.98
N$60
  Top 0.254: J53.1 37.85,39.37 36.32,37.85 33.27,37.85 29.98,34.55 IC2.64
N$61
  Top 0.254: J54.1 36.58,41.91 36.58,39.37 35.56,38.35 33.02,38.35 29.48,34.81 IC2.65
N$62
  Top 0.254: J55.1 35.31,39.37 34.8,38.86 32.77,38.86 28.98,35.08 IC2.66
N$63
  Top 0.254: J56.1 34.04,41.91 34.04,40.13 33.27,39.37 32.51,39.37 28.48,35.34 IC2.67
N$64
  Top 0.254: IC2.68 27.98,35.6 32.77,40.39 J57.1
N$65
  Top 0.254: J58.1 31.5,41.91 31.5,39.88 27.48,35.86 IC2.69
N$66
  Top 0.254: J59.1 30.23,39.62 26.98,36.38 IC2.70
N$67
  Top 0.254: J60.1 28.96,41.91 28.96,39.37 26.48,36.89 IC2.71
N$68
  Top 0.254: J61.1 27.69,39.37 24.98,36.66 IC2.74
N$69
  Top 0.254: J62.1 26.42,41.91 26.42,38.86 24.48,36.93 IC2.75
N$70
  Top 0.254: J63.1 22.61,37.85 20.32,35.56 20.32,29.97 21.16,29.13 IC2.78
N$71
  Top 0.254: J64.1 18.8,41.91 18.8,28.7 20.87,26.63 IC2.83
N$72
  Top 0.254: J65.1 17.53,39.37 18.29,38.61 18.29,28.45 20.61,26.13 IC2.84
N$73
  Top 0.254: J66.1 16.26,41.91 16.26,39.37 17.78,37.85 17.78,28.19 20.34,25.63 IC2.85
N$74
  Top 0.254: J67.1 14.99,39.37 17.27,37.08 17.27,27.94 20.08,25.13 IC2.86
N$77
  Top 0.254: J70.1 16.26,6.35 16.26,8.89 19.56,12.19 19.56,19.05 20.64,20.13 IC2.96
N$78
  Top 0.254: J71.1 17.53,8.89 20.07,11.43 20.07,18.8 20.9,19.63 IC2.97
N$79
  Top 0.254: J74.1 25.15,38.35 22.48,35.69 IC2.76
N$80
  Top 0.254: J75.1 23.88,41.91 23.88,38.35 20.83,35.31 20.83,30.23 21.42,29.63 IC2.77
N$81
  Top 0.254: J76.1 21.34,41.91 21.34,37.34 19.81,35.81 19.81,29.21 21.39,27.63 IC2.81
N$84
  Top 0.254: R2.2 LED1.2
TCK
  Top 0.254: J79.1 12.45,8.89 18.03,14.48 18.03,19.81 20.85,22.63 IC2.91 | J2.1 4.83,8.89 6.17,10.23 RN1.4
  Bottom 0.254: J79.1 11.18,8.89 J2.1
TDI
  Top 0.254: J80.1 13.72,6.35 13.72,8.89 18.54,13.72 18.54,19.56 20.11,21.13 IC2.94 | J2.5 4.83,11.43 5.23,11.83 RN1.2
  Bottom 0.254: J80.1 13.72,6.35 13.72,8.89 11.18,11.43 J2.5
TDO
  Top 0.254: J81.1 14.99,8.89 19.05,12.95 19.05,19.3 20.38,20.63 IC2.95 | J2.7 4.01,12.63 RN1.1
  Bottom 0.254: J81.1 14.99,8.89 11.18,12.7 J2.7
TMS  (via drill 0.51)
  Top 0.254: J78.1 11.18,6.35 11.18,8.89 11.56,9.27 | 11.56,9.27 17.53,15.24 17.53,20.07 20.59,23.13 IC2.90 | J2.3 4.83,10.16 5.7,11.03 RN1.3 | v10.41,10.16 10.67,10.16 11.56,9.27
  Bottom 0.254: v10.41,10.16 J2.3
V_USB  (via drill 0.51)
  Top 0.381: v3.3,24.89 3.59,25.43 J1.1
  Bottom 0.508: v3.3,24.89 7.11,24.89 8.66,26.44 IC1.3 10.36,28.4 10.92,28.96 C1.2

### Text on the board
tValues: LCMXO2-2000HC | www.taradov.com | AT | 12/29/19